# EasyEDA Pro project 蓝牙歌词音箱.epro, schematic Schematic2
Create Date: 2023-08-27; Page Name: P1; Project Name: 袁萌的蓝牙音箱; Schematic Name: Schematic2; Update Date: 2023-08-28
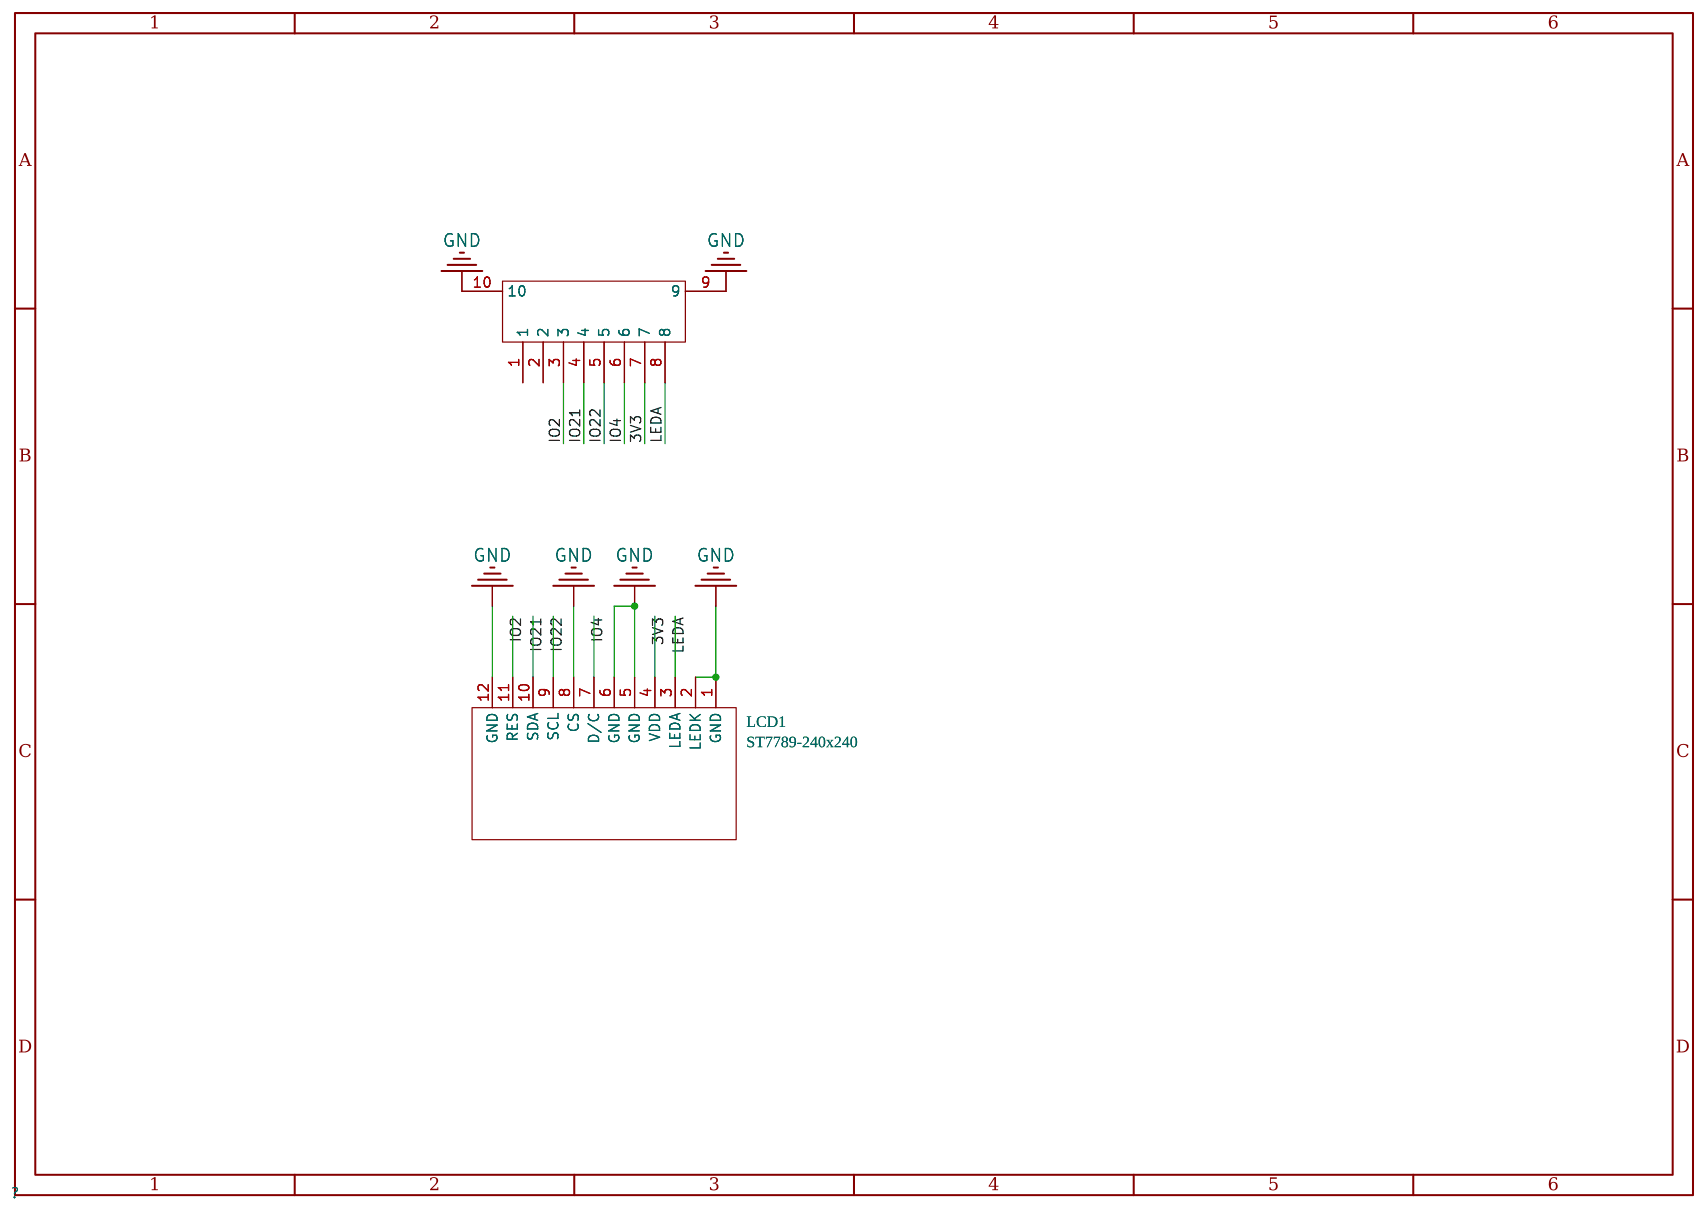
[diagram p0: schematic sheet]

## Parts
FPC1  AFC01-S08FCA-00  [FPC-SMD_P0.50-8P_FGS-XJ-H2.0]
LCD1  ST7789-240x240  [LCD-240X240-12P-1.54]

## Library data of the parts
FPC1 = AFC01-S08FCA-00: 间距:0.5mm;触点数量:8P;锁定特性:翻盖式;安装类型:卧贴;触点类型:下接;; LCSC Part Name: 0.5mm P数:8P 翻盖式 下接; Supplier Part: C262657; Manufacturer: JS(钜硕电子); Supplier Footprint: SMD,P=0.5mm; JLCPCB Part Class: 扩展库; Datasheet: https://atta.szlcsc.com/upload/public/pdf/source/20190816/C413942_2A72D1AC756EAE17EEDF756A339D4500.pdf; Supplier: LCSC; Pitch: 0.5mm; Number of Contacts: 8P; Locking Feature: 翻盖式; Mounting Type: 卧贴; Contact Type: 下接; Height Above Board: 2mm; FFC, FCB Thickness: 0.3mm
LCD1 = ST7789-240x240

## Nets
3V3: FPC1.7 LCD1.4(VDD)
GND: FPC1.9 FPC1.10 LCD1.1(GND) LCD1.2(LEDK) LCD1.5(GND) LCD1.6(GND) LCD1.8(CS) LCD1.12(GND)
IO2: FPC1.3 LCD1.11(RES)
IO4: FPC1.6 LCD1.7(D/C)
IO21: FPC1.4 LCD1.10(SDA)
IO22: FPC1.5 LCD1.9(SCL)
LEDA: FPC1.8 LCD1.3(LEDA)

Not connected (* = marked no-connect by the designer): FPC1 1 2
